# Altium project tesis.PrjPcb (part 1 of 3)
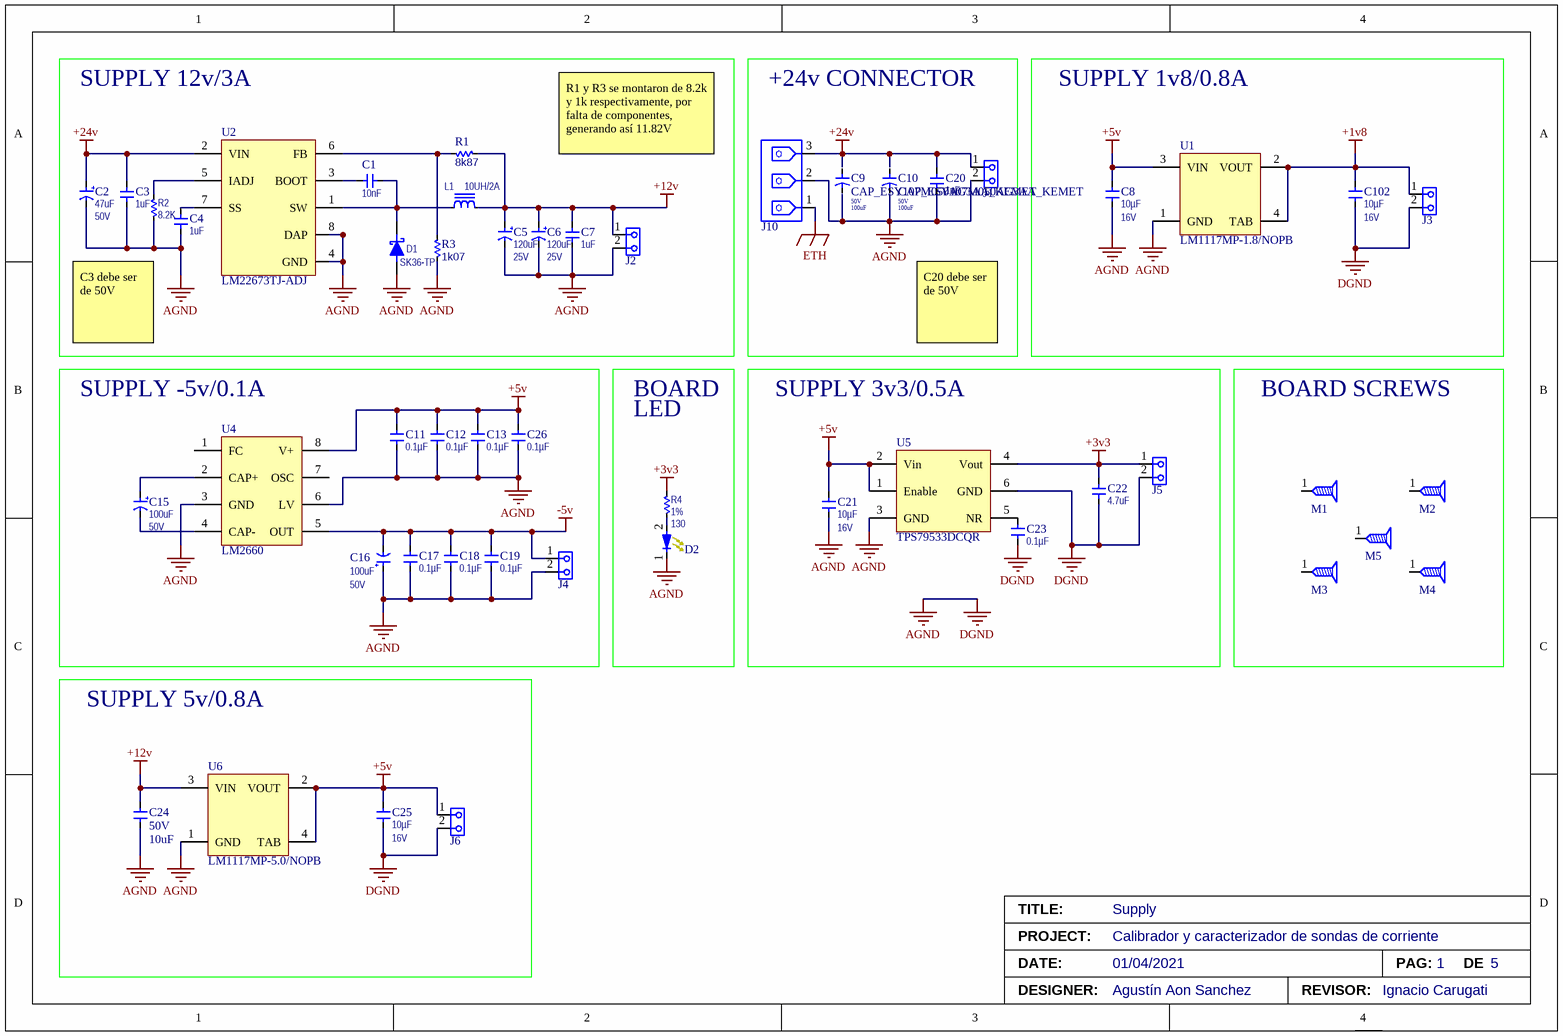
[diagram p0: tesis_page1_supply.SchDoc]
5 sheets, 272 parts. Net scope: global (net labels, ports and power ports of the same name join across sheets).
Board file: tesis.PcbDoc
Sheets:
  tesis_page1_supply.SchDoc
  tesis_page2_arm.SchDoc
  tesis_page3_power_stage.SchDoc
  tesis_page4_adc.SchDoc
  tesis_page5_adc_channels.SchDoc

## Sheet tesis_page1_supply.SchDoc: Supply
size A4; Date: 01/04/2021; Author: Agustín Aon Sanchez; DrawnBy: Agustín Aon Sanchez; SheetNumber: 1; SheetTotal: 5

### Parts
C1  value 10nF  [CAPC3216X135N_B]  (hidden comment: CAP_C3216X7R2J103K115AA_TDK)
C2  value 47uF  Voltage Rating: 50V  [CAPAE630770X770N]  (hidden comment: CAP_EEE-1HA470XP_PANASONIC)
C3  value 1uF  [CAPC3216X135N_B]  (hidden comment: CAP_C3216X7R1E105M085AA_TDK)
C4  value 1uF  [CAPC3216X135N_B]  (hidden comment: CAP_C3216X7R1E105M085AA_TDK)
C5  value 120uF  Voltage Rating: 25V  [CAPPRD250W50D630H1250]  (hidden comment: CAP_ELXY250ELL121MF15D_UC)
C6  value 120uF  Voltage Rating: 25V  [CAPPRD250W50D630H1250]  (hidden comment: CAP_ELXY250ELL121MF15D_UC)
C7  value 1uF  [CAPC3216X135N_B]  (hidden comment: CAP_C3216X7R1E105M085AA_TDK)
C8  value 10µF  Voltage Rating: 16V  [CAPC2013X110N]  (hidden comment: CAP_CL21A106KOCL3RC)
C9  CAP_ESY107M050AG3AA_KEMET  Voltage: 50V  Capacitance: 100uF  [cap elec 8x11.5]
C10  CAP_ESY107M050AG3AA_KEMET  Voltage: 50V  Capacitance: 100uF  [cap elec 8x11.5]
C11  value 0.1µF  [CAPC2013X110N]  (hidden comment: CAP_CC0805KRX7R8BB104_YAGEO)
C12  value 0.1µF  [CAPC2013X110N]  (hidden comment: CAP_CC0805KRX7R8BB104_YAGEO)
C13  value 0.1µF  [CAPC2013X110N]  (hidden comment: CAP_CC0805KRX7R8BB104_YAGEO)
C15  value 100uF  Voltage Rating: 50V  [CAPPRD350W60D800H1200]  (hidden comment: CAP_   ESY107M050AG3AA_KEMET)
C16  value 100uF  Voltage Rating: 50V  [CAPPRD350W60D800H1200]  (hidden comment: CAP_   ESY107M050AG3AA_KEMET)
C17  value 0.1µF  [CAPC2013X110N]  (hidden comment: CAP_CC0805KRX7R8BB104_YAGEO)
C18  value 0.1µF  [CAPC2013X110N]  (hidden comment: CAP_CC0805KRX7R8BB104_YAGEO)
C19  value 0.1µF  [CAPC2013X110N]  (hidden comment: CAP_CC0805KRX7R8BB104_YAGEO)
C20  value 1uF  [CAPC3216X135N_B]
C21  value 10µF  Voltage Rating: 16V  [CAPC2013X110N]  (hidden comment: CAP_CL21A106KOCL3RC)
C22  value 4.7uF  [CAPC2013X110N]  (hidden comment: CAP_CC0805KKX5R8BB475_YAGEO_1)
C23  value 0.1µF  [CAPC2013X110N]  (hidden comment: CAP_CC0805KRX7R8BB104_YAGEO)
C24  value 10uF  Voltage Rating: 50V  [CAPC3216X135N_B]  (hidden comment: CAP_GRT31CR61H106ME01L)
C25  value 10µF  Voltage Rating: 16V  [CAPC2013X110N]  (hidden comment: CAP_CL21A106KOCL3RC)
C26  value 0.1µF  [CAPC2013X110N]  (hidden comment: CAP_CC0805KRX7R8BB104_YAGEO)
C102  value 10µF  Voltage Rating: 16V  [CAPC2013X110N]  (hidden comment: CAP_CL21A106KOCL3RC)
D1  SK36-TP  [DIOM7959X262N]
D2  DIO_150080YS75000_WURTH  [DIO0805]  (value not drawn)
J1  CON_Header_1x2  [RAD2]  (value not drawn)
J2  CON_Header_1x2  [RAD2]  (value not drawn)
J3  CON_Header_1x2  [RAD2]  (value not drawn)
J4  CON_Header_1x2  [RAD2]  (value not drawn)
J5  CON_Header_1x2  [RAD2]  (value not drawn)
J6  CON_Header_1x2  [RAD2]  (value not drawn)
J10  CON_691137710003  [CON_691137710003]  (value not drawn)
L1  value 10UH/2A  [MAG_INDUCTOR2A]  (hidden comment: MAG_SRR1005-100M_BOURNS)
M1  MSC_SCREW  [MH320]  (value not drawn)  (no BOM)
M2  MSC_SCREW  [MH320]  (value not drawn)  (no BOM)
M3  MSC_SCREW  [MH320]  (value not drawn)  (no BOM)
M4  MSC_SCREW  [MH320]  (value not drawn)  (no BOM)
M5  MSC_SCREW  [MH320]  (value not drawn)  (no BOM)
R1  value 8k87  [RESC2013X065BN]  (hidden comment: RES_RC0805FR-078K87L)
R2  value 8.2K  [RESC3216N]  (hidden comment: RES_ERJ-8GEYJ822V_Panasonic)
R3  value 1k07  [RESC2013X065BN]  (hidden comment: RES_RC0805FR-071K07L)
R4  value 130  Tolerance: 1%  [RESC2013X065BN]  (hidden comment: RES_RC0805FR-07130RL_YAGEO)
U1  LM1117MP-1.8/NOPB  [SOT223-3L]
U2  LM22673TJ-ADJ  [TJ7A_N]
U4  LM2660  [SOIC127P600-8BN]
U5  TPS79533DCQR  [SOT223-6L]
U6  LM1117MP-5.0/NOPB  [SOT223-3L]

### Blocks framed on the sheet
SUPPLY 12v/3A: C1-C7 D1 J2 L1 R1-R3 U2
+24v CONNECTOR: C9 C10 C20 J1 J10
SUPPLY 1v8/0.8A: C8 C102 J3 U1
SUPPLY -5v/0.1A: C11-C13 C15-C19 C26 J4 U4
SUPPLY 3v3/0.5A: C21-C23 J5 U5
BOARD SCREWS: M1-M5
SUPPLY 5v/0.8A: C24 C25 J6 U6

### Nets
+1v8: C102.1(T1) J3.1 U1.2(VOUT) U1.4(TAB)
+3v3: C22.1(T1) J5.1 R4.2(T2) U5.4(Vout)
+5v: C8.1(T1) C11.1(T1) C12.1(T1) C13.1(T1) C21.1(T1) C25.1(T1) C26.1(T1) J6.1 U1.3(VIN) U4.8(V+) U5.1(Enable) U5.2(Vin) U6.2(VOUT) U6.4(TAB)
+12v: C5.1 C6.1 C7.1(T1) C24.1(T1) J2.1 L1.2 R1.1(T1) U6.3(VIN)
+24v: C2.1 C3.1(T1) C20.1(T1) J1.1 J10.3 U2.2(VIN)
-5v: C16.2 C17.1(T1) C18.1(T1) C19.1(T1) J4.1 U4.5(OUT)
AGND: C2.2 C3.2(T2) C4.2(T2) C5.2 C6.2 C7.2(T2) C8.2(T2) C11.2(T2) C12.2(T2) C13.2(T2) C16.1 C17.2(T2) C18.2(T2) C19.2(T2) C20.2(T2) C21.2(T2) C22.2(T2) C23.2(T2) C24.2(T2) C25.2(T2) C26.2(T2) C102.2(T2) D1.2(A) D2.1(Cathode) J1.2 J2.2 J3.2 J4.2 J5.2 J6.2 J10.2 R2.1(T1) R3.1(T1) U1.1(GND) U2.4(GND) U2.8(DAP) U4.3(GND) U4.6(LV) U5.3(GND) U5.6(GND) U6.1(GND)  [also labelled DGND]
ETH: J10.1
NetC1_1: C1.1(T1) U2.3(BOOT)
NetC1_2: C1.2(T2) D1.1(K) L1.1 U2.1(SW)
NetC4_1: C4.1(T1) U2.7(SS)
NetC15_1: C15.1 U4.2(CAP+)
NetC15_2: C15.2 U4.4(CAP-)
NetC23_1: C23.1(T1) U5.5(NR)
NetD2_2: D2.2(Anode) R4.1(T1)
NetR1_2: R1.2(T2) R3.2(T2) U2.6(FB)
NetR2_2: R2.2(T2) U2.5(IADJ)

Not connected (* = marked no-connect by the designer): C9 24 25; C10 24 25; M1 1; M2 1; M3 1; M4 1; M5 1; U4 1(FC) 7(OSC)

### Notes on the sheet
- R1 y R3 se montaron de 8.2k y 1k respectivamente, por falta de componentes, generando así 11.82V
- C3 debe ser de 50V
- C20 debe ser de 50V
- BOARD
- LED
- TITLE:
- PROJECT:
- DATE:
- DESIGNER:
- Calibrador y caracterizador de sondas de corriente
- 01/04/2021
- Agustín Aon Sanchez
- REVISOR:
- Ignacio Carugati
- PAG:
- DE

### Library data of the parts
C1 = CAP_C3216X7R2J103K115AA_TDK: 10000pF, 630 V, Capacitores cerámicos, X7R, 1206 (3216 métrico), 0.126" L x 0.063" A (3.20 mm x 1.60 mm); Manufacturer: TDK; Tolerance: 10%; Voltage Rating: 630 V; Supplier: *; Supplier Part No: *; Power Rating: *; BOM Populate: *; Digikey Part Number: 445-2291-1-ND; Mouser Part Number: 810-C3216X7R2J103K; Manufacturer Part Number: C3216X7R2J103K115AA
C2 = CAP_EEE-1HA470XP_PANASONIC: 47µF 50V Aluminum Capacitors Radial, Can - SMD 2000 Hrs @ 85°C; Tolerance: 20%; BOM Populate: *; Power Rating: *; Supplier Part No: *; Supplier: *; Manufacturer: Panasonic; Petra Part No: *; Digikey Part Number: PCE3929CT-ND; Mouser Part Number: 667-EEE-1HA470XP; Manufacturer Part Number: EEE-1HA470XP
C3 C4 C7 C20 = CAP_C3216X7R1E105M085AA_TDK: 1 µF, 25 V, Capacitores cerámicos, X7R, 1206 (3216 métrico), 0.126" L x 0.063" A (3.20 mm x 1.60 mm); Manufacturer: TDK; Tolerance: 20%; Voltage Rating: 25V; Supplier: *; Supplier Part No: *; Power Rating: *; BOM Populate: *; Digikey Part Number: 445-4024-1-ND; Mouser Part Number: 810-C3216X7R1E105M-2; Manufacturer Part Number: C3216X7R1E105M085AA
C5 C6 = CAP_ELXY250ELL121MF15D_UC: CAP ALUM 120UF 20% 25V RADIAL; BOM Populate: *; Power Rating: *; Supplier Part No: *; Supplier: *; Digikey Part Number: 565-1791-ND; Tolerance: 20%; Petra Part No: *; Mouser Part Number: 661-ELXY250ELL121MF1; Manufacturer Part Number: ELXY250ELL121MF15D
C8 C21 C25 C102 = CAP_CL21A106KOCL3RC: CAP CER 10UF 16V X5R 0805; Manufacturer: Samsung; Tolerance: 10%; Manufacturer Part Number: CL21A106KOCL3RC; Supplier 1: Future Electronics; RoHS: Yes; Category: Ceramic Capacitors; Stock 1: 3934; Pricing 1: 1=0,10400, 50=0,08230, 100=0,07900, 500=0,07190, 1500=0,06740 (USD); Mount: Surface Mount; Case/Package: 0805; Case Code (Metric): 2012; Case Code (Imperial): 0805; Min Operating Temperature: -55°C; Max Operating Temperature: 85°C; Package Quantity: 1; Packaging: Tape and Reel; Length: 0.079inch; Width: 0.049inch; Thickness: 0.037inch; ComponentLink1URL: https://datasheet.ciiva.com/25796/cl21a106kocl3rc-25796224.pdf?src-supplier=Digi-Key; ComponentLink1Description: https://datasheet.ciiva.com/25796/cl21a106kocl3rc-25796224.pdf?src-supplier=Digi-Key; Supplier Part Number 1: 8109145; Capacitance: 10µF
C9 C10 = CAP_ESY107M050AG3AA_KEMET: KEMET - ESY107M050AG3AA - Elektrolytkondensator, 100 µF, 50 V, Produktreihe ESY, ± 20%, Radial bedrahtet, 8 mm; Dielectric Material: Aluminium; Ripple Current: 511mA; Life (Hours): 3000Hour; Leakage Current: 50uA; Dissipation Factor: 0.1%; Lead/Base Style: Straight; Impedance: 74mR; Lead Diameter: 0.6mm; Lead Length: 20mm; Tolerance: 20%; Voltage Rating: 50V; Supplier 1: Digi-Key; Manufacturer 1: KEMET; Manufacturer Part Number 1: ESY107M050AG3AA; Stock 1: 587; Pricing 1: 1=0,44000, 10=0,30700, 50=0,21500, 100=0,18420, 500=0,13818, 1000=0,11668, 2500=0,11054, 5000=0,10440 (USD); RoHS: Yes; Mount: Through Hole,PCB; Case/Package: Radial; Min Operating Temperature: -40°C; Max Operating Temperature: 105°C; Termination: Radial; Packaging: Bulk; Voltage Rating (DC): 50V; Package Quantity: 6000; Series: ESY; ESR (Equivalent Series Resistance): 74mR; Diameter: 8mm; Length: 11mm; Height: 11mm; Lead Pitch: 3.5mm; Height - Seated (Max): 0.492inch; Radiation Hardening: No; RoHS Compliant: Yes; ComponentLink1URL: http://www.farnell.com/datasheets/2751412.pdf?src-supplier=Farnell; ComponentLink1Description: http://www.farnell.com/datasheets/2751412.pdf?src-supplier=Farnell; ComponentLink2URL: http://www.mouser.com/ds/2/212/KEM_A4007_ESY-1103537.pdf?src-supplier=Mouser; ComponentLink2Description: http://www.mouser.com/ds/2/212/KEM_A4007_ESY-1103537.pdf?src-supplier=Mouser; ComponentLink3URL: http://components.arrow.com/part/dataview/0323_06946698?src-supplier=Arrow+Europe; ComponentLink3Description: http://components.arrow.com/part/dataview/0323_06946698?src-supplier=Arrow+Europe; ComponentLink4URL: https://www.alliedelec.com/m/d/2f7883d23207e2a46fd2b27bea013c02.pdf?src-supplier=Allied+Electronics; ComponentLink4Description: https://www.alliedelec.com/m/d/2f7883d23207e2a46fd2b27bea013c02.pdf?src-supplier=Allied+Electronics; ComponentLink5URL: http://uk.rs-online.com/webdocs/13da/0900766b813da6ab.pdf?src-supplier=RSComponents; ComponentLink5Description: http://uk.rs-online.com/webdocs/13da/0900766b813da6ab.pdf?src-supplier=RSComponents; ComponentLink6URL: https://api.kemet.com/component-edge/download/specsheet/ESY107M050AG3AA.pdf?src-supplier=Digi-Key; ComponentLink6Description: https://api.kemet.com/component-edge/download/specsheet/ESY107M050AG3AA.pdf?src-supplier=Digi-Key; ComponentLink7URL: http://capacitoredge.kemet.com/capedge2/DataSheet?pn=ESY107M050AG3AA&src-supplier=Avnet; ComponentLink7Description: http://capacitoredge.kemet.com/capedge2/DataSheet?pn=ESY107M050AG3AA&src-supplier=Avnet; ComponentLink8URL: http://capacitoredge.kemet.com/capedge2/DataSheet/Datasheet-ESY107M050AG3AA.pdf?pn=ESY107M050AG3AA&src-supplier=Onlinecomponents.com; ComponentLink8Description: http://capacitoredge.kemet.com/capedge2/DataSheet/Datasheet-ESY107M050AG3AA.pdf?pn=ESY107M050AG3AA&src-supplier=Onlinecomponents.com; ComponentLink9URL: http://capacitoredge.kemet.com/capedge2/DataSheet?pn=ESY107M050AG3AA&src-supplier=Avnet+Europe; ComponentLink9Description: http://capacitoredge.kemet.com/capedge2/DataSheet?pn=ESY107M050AG3AA&src-supplier=Avnet+Europe; ComponentLink10URL: http://www.farnell.com/datasheets/2751412.pdf?src-supplier=Newark; ComponentLink10Description: http://www.farnell.com/datasheets/2751412.pdf?src-supplier=Newark; Supplier Part Number 1: 399-6119-ND
C11-C13 C17-C19 C23 C26 = CAP_CC0805KRX7R8BB104_YAGEO: CAP CER 0.1UF 25V 10% X7R 0805; Manufacturer: Yageo; Digikey Part Number: 311-1141-1-ND; Supplier: *; Tolerance: 10%; Power Rating: *; Voltage Rating: 25V; BOM Populate: *; Mouser Part Number: 603-CC805KRX7R8BB104; Manufacturer Part Number: CC0805KRX7R8BB104
C15 C16 = CAP_   ESY107M050AG3AA_KEMET: CAP ALUM 100UF 20% 50V RADIAL; BOM Populate: *; Power Rating: *; Supplier Part No: *; Supplier: *; Digikey Part Number: 399-6119-ND; Tolerance: 20%; Petra Part No: *; Mouser Part Number: 80-ESY107M050AG3AA; Manufacturer Part Number: ESY107M050AG3AA
C22 = CAP_CC0805KKX5R8BB475_YAGEO_1: CAP CER 4.7UF 25V X5R 0805; Manufacturer: YAGEO; Tolerance: 10%; Voltage Rating: 25V; Digikey Part Number: 311-1904-1-ND; Mouser Part Number: 603-CC805KKX5R8BB475; Manufacturer Part Number: CC0805KKX5R8BB475
C24 = CAP_GRT31CR61H106ME01L: Cap Ceramic 10uF 50V X5R 20% Pad SMD 1206 85C Automotive T/R; Manufacturer: Murata; Tolerance: 20%; Manufacturer Part Number: GRT31CR61H106ME01L; Supplier 1: Digi-Key; RoHS: Yes; Category: Ceramic Capacitors; Stock 1: 575627; Pricing 1: 1=0,46000, 10=0,31800, 50=0,22240, 100=0,19060, 500=0,14294, 1000=0,12070 (USD); Mount: Surface Mount; Case/Package: 1206; Case Code (Metric): 3216; Case Code (Imperial): 1206; Min Operating Temperature: -55°C; Max Operating Temperature: 85°C; Packaging: Tape and Reel; Length: 0.126inch; Width: 0.063inch; Thickness: 0.071inch; ComponentLink1URL: http://search.murata.co.jp/Ceramy/image/img/A01X/G101/ENG/GRT31CR61H106ME01-01.pdf?src-supplier=Digi-Key; ComponentLink1Description: http://search.murata.co.jp/Ceramy/image/img/A01X/G101/ENG/GRT31CR61H106ME01-01.pdf?src-supplier=Digi-Key; Supplier Part Number 1: 490-12457-1-ND; Ratings: AEC-Q200; RoHS Compliant: Yes
D1 = DIO_SK36_MICROCOM: DIODE SCHOTTKY 60V 3A SMC; Manufacturer: Micro Commercial Co; Digikey Part Number: SK36-TPMSCT-ND; Manufacturer Part Number: SK36-TP; Mouser Part Number: 833-SK36-TP
D2 = DIO_150080YS75000_WURTH: LED YELLOW CLEAR 0805 SMD; Manufacturer: Wurth Electronics Inc.; Manufacturer Part Number: 150080YS75000; Digikey Part Number: 732-4987-1-ND; Mouser Part Number: 710-150080YS75000
J10 = CON_691137710003: TERM BLK 3POS SIDE ENTRY 5MM PCB; Manufacturer: Wurth Electronics; Supplier 1: Digi-Key; Supplier Part Number 1: 732-10956-ND; Manufacturer Part Number: 691137710003; RoHS: No; Stock 1: 910; Pricing 1: 1=0,62000, 10=0,55000, 50=0,49000, 100=0,44000, 500=0,42000 (USD); ComponentLink1URL: https://katalog.we-online.de/em/datasheet/691137710003.pdf?src-supplier=Digi-Key; ComponentLink1Description: https://katalog.we-online.de/em/datasheet/691137710003.pdf?src-supplier=Digi-Key
L1 = MAG_SRR1005-100M_BOURNS: FIXED IND 10UH 2A 65 MOHM SMD; Manufacturer: Bourns Inc; BOM Populate: *; Current Rating: *; Supplier: *; Supplier Part No: *; Voltage Rating: *; Tolerance: *; Digikey Part Number: SRR1005-100MCT-ND; Manufacturer Part Number: SRR1005-100M; Mouser Part Number: 652-SRR1005-100M
M1-M5 = MSC_SCREW: SCREW; BOM Populate: *; Tolerance: *; Power Rating: *; Voltage Rating: *
R1 = RES_RC0805FR-078K87L: Res Thick Film 0805 8.87K Ohm 1% 0.125W(1/8W) ±100ppm/C Epoxy Pad SMD T/R; Manufacturer: Yageo; Temperature Coefficient: 100ppm/°C; Power Rating: 125mW; Voltage Rating: 150V; Supplier 1: Digi-Key; Supplier Part Number 1: 311-8.87KCRCT-ND; Manufacturer Part Number: RC0805FR-078K87L; Category: Chip SMD Resistors; Case/Package: 0805; Contact Plating: Tin,Lead,Matte; Case Code (Metric): 2012; Case Code (Imperial): 0805; Size Code: 0805; Min Operating Temperature: -55°C; Max Operating Temperature: 155°C; Tolerance: 1%; Resistor Type: Thick Film; Package Quantity: 1; Packaging: Tape and Reel; Number of Terminations: 2; Termination: SMD/SMT; Max Power Dissipation: 125mW; Voltage Rating (DC): 150V; Features: Moisture Resistant; Series: RC; Construction: Rectangular; Length: 2mm; Width: 0.049inch; Height: 0.024inch; Depth: 1.25mm; Radiation Hardening: No; Military Standard: Not; Lead Free: Lead Free; RoHS Compliant: Yes; ComponentLink1URL: https://datasheet.ciiva.com/17423/rc0805-17423031.pdf?src-supplier=Future+Electronics; ComponentLink1Description: https://datasheet.ciiva.com/17423/rc0805-17423031.pdf?src-supplier=Future+Electronics; ComponentLink2URL: https://datasheet.ciiva.com/2491/pyu-r-int-thick-7-2491576.pdf?src-supplier=Digi-Key; ComponentLink2Description: https://datasheet.ciiva.com/2491/pyu-r-int-thick-7-2491576.pdf?src-supplier=Digi-Key; ComponentLink3URL: https://datasheet.ciiva.com/2491/pyu-r-int-thick-7-2491577.pdf?src-supplier=Digi-Key; ComponentLink3Description: https://datasheet.ciiva.com/2491/pyu-r-int-thick-7-2491577.pdf?src-supplier=Digi-Key; ComponentLink4URL: https://datasheet.ciiva.com/2491/pyu-r-int-thick-7-2491578.pdf?src-supplier=Digi-Key; ComponentLink4Description: https://datasheet.ciiva.com/2491/pyu-r-int-thick-7-2491578.pdf?src-supplier=Digi-Key
R2 = RES_ERJ-8GEYJ822V_Panasonic: RES SMD 8.2K OHM 5% 1/4W 1206; BOM Populate: *; Supplier Part No: *; Supplier: *; Tolerance: 5%; Manufacturer: Panasonic; Digikey Part Number: P8.2KECT-ND; Power Rating: 1/4W; Manufacturer Part Number: ERJ-8GEYJ822V; Mouser Part Number: 667-ERJ-8GEYJ822V
R3 = RES_RC0805FR-071K07L: Res Thick Film 0805 1.07K Ohm 1% 1/8W 100ppm/C Molded SMD Paper T/R; Manufacturer: Yageo; Resistance: 1.07kR; Temperature Coefficient: 100ppm/°C; Power Rating: 125mW; Voltage Rating: 150V; Supplier 1: Digi-Key; Manufacturer Part Number: RC0805FR-071K07L; RoHS: Yes; Category: Chip SMD Resistors; Stock 1: 47079; Pricing 1: 1=0,10000, 10=0,04000, 100=0,01620, 1000=0,00726, 2500=0,00630 (USD); Case/Package: 0805; Contact Plating: Tin,Matte; Case Code (Imperial): 0805; Case Code (Metric): 2012; Size Code: 0805; Min Operating Temperature: -55°C; Max Operating Temperature: 155°C; Tolerance: 1%; Resistor Type: Thick Film; Packaging: Tape and Reel; Package Quantity: 1; Termination: SMD/SMT; Number of Terminations: 2; Max Power Dissipation: 125mW; Voltage Rating (DC): 150V; Features: Moisture Resistant; Series: RC; Construction: Rectangular; Length: 2mm; Width: 1.25mm; Height: 0.024inch; Depth: 1.25mm; Military Standard: Not; Lead Free: Lead Free; RoHS Compliant: Yes; ComponentLink1URL: https://datasheet.ciiva.com/17054/rc0805-17054582.pdf?src-supplier=Future+Electronics; ComponentLink1Description: https://datasheet.ciiva.com/17054/rc0805-17054582.pdf?src-supplier=Future+Electronics; ComponentLink2URL: https://datasheet.ciiva.com/2491/pyu-r-int-thick-7-2491690.pdf?src-supplier=Digi-Key; ComponentLink2Description: https://datasheet.ciiva.com/2491/pyu-r-int-thick-7-2491690.pdf?src-supplier=Digi-Key; ComponentLink3URL: https://datasheet.ciiva.com/2491/pyu-r-int-thick-7-2491691.pdf?src-supplier=Digi-Key; ComponentLink3Description: https://datasheet.ciiva.com/2491/pyu-r-int-thick-7-2491691.pdf?src-supplier=Digi-Key; ComponentLink4URL: https://datasheet.ciiva.com/2491/pyu-r-int-thick-7-2491692.pdf?src-supplier=Digi-Key; ComponentLink4Description: https://datasheet.ciiva.com/2491/pyu-r-int-thick-7-2491692.pdf?src-supplier=Digi-Key; Supplier Part Number 1: 311-1.07KCRCT-ND
R4 = RES_RC0805FR-07130RL_YAGEO: RES SMD 130 OHM 1% 1/8W 0805; Manufacturer: Yageo; BOM Populate: *; Supplier Part No: *; Supplier: *; Digikey Part Number: 311-130CRCT-ND; Power Rating: 1/8W; Manufacturer Part Number: RC0805FR-07130RL; Mouser Part Number: 603-RC0805FR-07130RL
U1 = IC_LM1117MP-1.8/NOPB: IC REG LDO 1.8V .8A SOT-223-4; Manufacturer: TI National Semiconductor; Number of Terminals/Pins: 4; Number of Outputs: 1; Max Input Voltage: 15V; Max Output Current: 800mA; Polarity: Positive; Quiescent Current: 10mA; Accuracy: 1%; Output Type: Fixed; Dropout Voltage: 1.2V; Min Input Voltage: 2.6V; Current Rating: 800A; Supplier 1: Digi-Key; Manufacturer Part Number: LM1117MP-1.8/NOPB; RoHS: Yes; Category: Voltage Regulators - Linear; Stock 1: 6695; Pricing 1: 1=1,10000, 10=0,98500, 25=0,93520, 100=0,71810, 250=0,63460, 500=0,60120 (USD); Mount: Surface Mount; Case/Package: SOT-223; Number of Pins: 4; Min Operating Temperature: 0°C; Max Operating Temperature: 125°C; Output Voltage: 1.8V; Output Current: 800mA; Packaging: Tape and Reel; Nominal Output Voltage: 1.8V; Output Voltage Accuracy: 1%; Package Quantity: 1000; Length: 6.5mm; Width: 3.56mm; Height: 1.6mm; Radiation Hardening: No; REACH SVHC: No SVHC; Lead Free: Lead Free; Supplier Part Number 1: LM1117MP-1.8/NOPBCT-ND
U2 = IC_LM22673TJ-ADJ: 3A SIMPLE SWITCHER® Step-Down Voltage Regulator with Adjustable Soft-Start and Current Limit, 7-pin TO-263 Thin; Manufacturer Part Number: LM22673TJ-ADJ/NOPB; Digikey Part Number: LM22673TJ-ADJ/NOPBCT-ND; Mouser Part Number: 926-LM22673TJADJNOPB
U4 = IC_LM2660MX/NOPB_1: IC REG SWTCHD CAP INV 0.1A 8SOIC; Digikey Part Number: LM2660MX/NOPBCT-ND; Manufacturer Part Number: LM2660MX/NOPB; Mouser Part Number: 926-LM2660MX/NOPB
U5 = IC_TPS79533DCQR_TI: IC REG LIN 3.3V 500MA SOT223-6; Manufacturer Part Number: 595-TPS79533DCQR; Digikey Part Number: 296-13810-1-ND; Mouser Part Number: TPS79533DCQR
U6 = IC_LM1117MP-5.0/NOPB: IC REG LDO 5V .8A SOT-223-4; Manufacturer: TI National Semiconductor; Number of Outputs: 1; Max Input Voltage: 15V; Max Output Current: 800mA; Polarity: Positive; Quiescent Current: 5mA; Accuracy: 1%; Output Type: Fixed; Dropout Voltage: 1.2V; Min Input Voltage: 2.6V; Current Rating: 800A; Max Supply Voltage: 12V; Max Supply Current: 10mA; Power Supply Rejection Ratio (PSRR): 75dB; Supplier 1: Digi-Key; Manufacturer Part Number: LM1117MP-5.0/NOPB; RoHS: Yes; Category: Voltage Regulators - Linear; Stock 1: 1093; Pricing 1: 1=1,17000, 10=1,04400, 25=0,99120, 100=0,76120, 250=0,67268, 500=0,63728 (USD); Mount: Surface Mount; Case/Package: SOT-223; Number of Pins: 4; Min Operating Temperature: 0°C; Max Operating Temperature: 125°C; Output Voltage: 5V; Output Current: 800mA; Packaging: Tape and Reel; Nominal Output Voltage: 5V; Output Voltage Accuracy: 1%; Package Quantity: 1000; Length: 6.5mm; Width: 3.56mm; Height: 1.6mm; Radiation Hardening: No; REACH SVHC: No SVHC; Lead Free: Lead Free; Supplier Part Number 1: LM1117MP-5.0/NOPBCT-ND; Contact Plating: Tin,Matte; Number of Regulators: 1; Min Current Limit: 800mA; Series: -; Output Configuration: Positive; RoHS Compliant: Yes

## Sheet tesis_page2_arm.SchDoc: ARM
size A4; Date: 01/04/2021; SheetNumber: 2; SheetTotal: 5
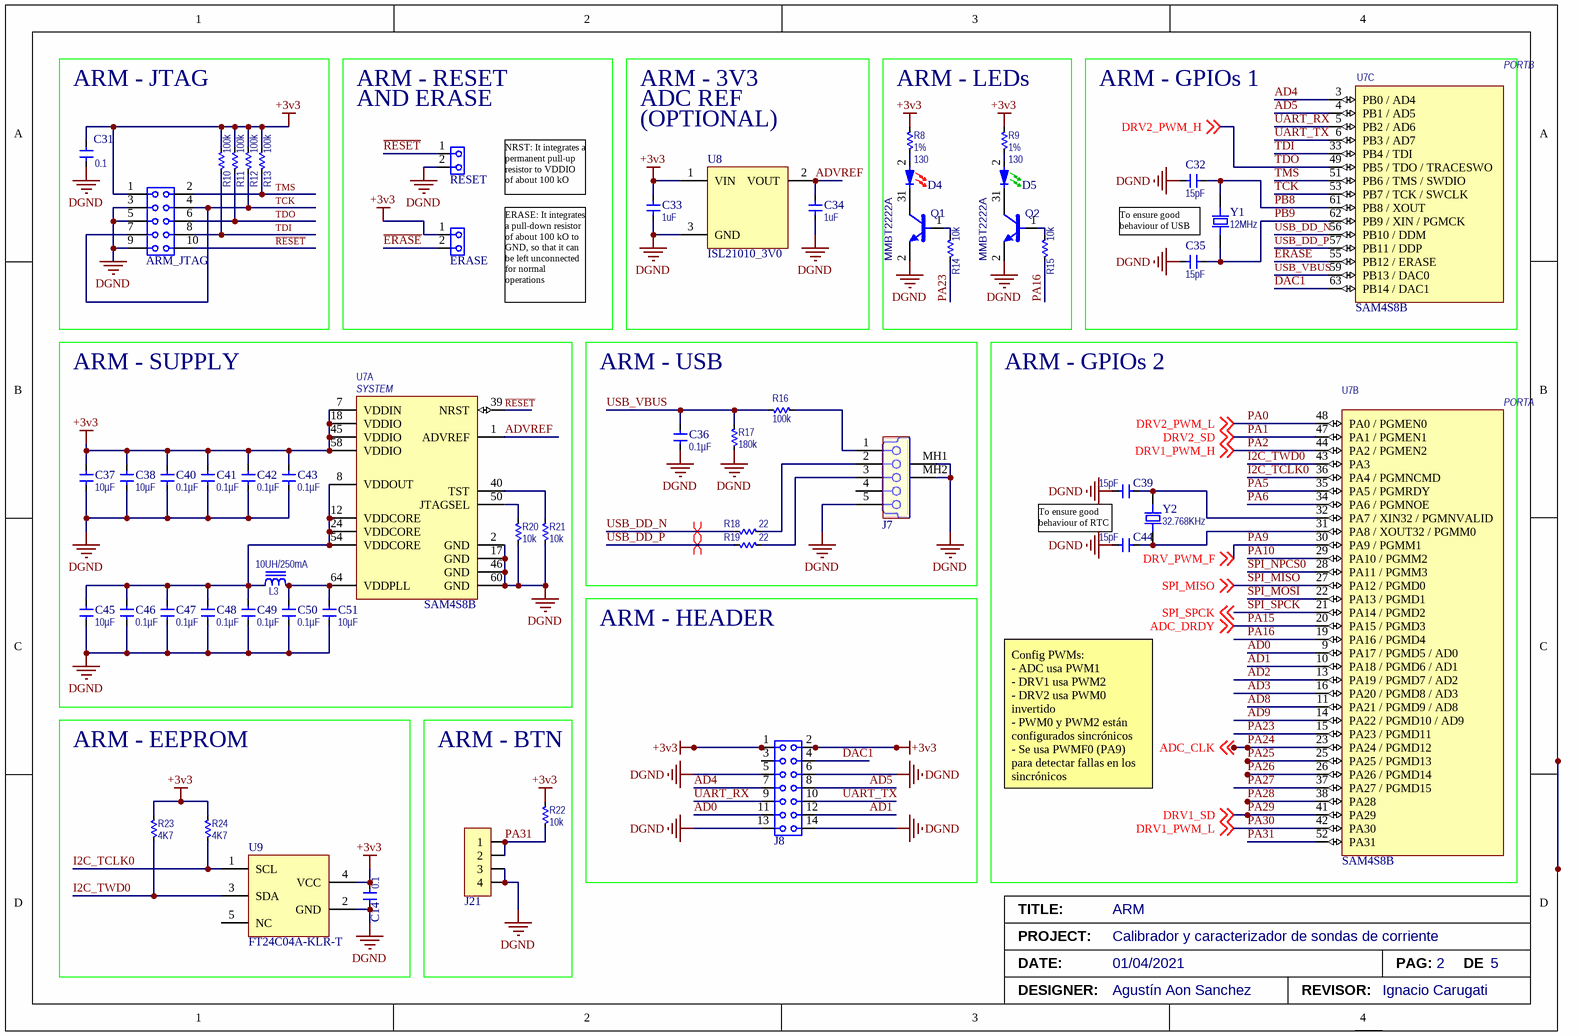
[diagram p1: tesis_page2_arm.SchDoc]

### Parts
ARM_JTAG  CON_20021121-00010C4LF_FCI  [FCI_20021121-00010C4LF]  (value not drawn)
C14  value 0.1  [CAPC2013X110N]  (hidden comment: CAP_CC0805KRX7R8BB104_YAGEO)
C31  value 0.1  [CAPC2013X110N]  (hidden comment: CAP_CC0805KRX7R8BB104_YAGEO)
C32  value 15pF  [CAPC2013X110N]  (hidden comment: CAP_C0805X150J5GACTU_KEMET)
C33  value 1uF  [CAPC2013X110N]  (hidden comment: CAP_CC0805KKX7R7BB105_YAGEO)
C34  value 1uF  [CAPC2013X110N]  (hidden comment: CAP_CC0805KKX7R7BB105_YAGEO)
C35  value 15pF  [CAPC2013X110N]  (hidden comment: CAP_C0805X150J5GACTU_KEMET)
C36  value 0.1µF  [CAPC2013X110N]  (hidden comment: CAP_CC0805KRX7R8BB104_YAGEO)
C37  value 10µF  [CAPC2013X110N]  (hidden comment: CAP_CL21A106KOCL3RC)
C38  value 10µF  [CAPC2013X110N]  (hidden comment: CAP_CL21A106KOCL3RC)
C39  value 15pF  [CAPC2013X110N]  (hidden comment: CAP_C0805X150J5GACTU_KEMET)
C40  value 0.1µF  [CAPC2013X110N]  (hidden comment: CAP_CC0805KRX7R8BB104_YAGEO)
C41  value 0.1µF  [CAPC2013X110N]  (hidden comment: CAP_CC0805KRX7R8BB104_YAGEO)
C42  value 0.1µF  [CAPC2013X110N]  (hidden comment: CAP_CC0805KRX7R8BB104_YAGEO)
C43  value 0.1µF  [CAPC2013X110N]  (hidden comment: CAP_CC0805KRX7R8BB104_YAGEO)
C44  value 15pF  [CAPC2013X110N]  (hidden comment: CAP_C0805X150J5GACTU_KEMET)
C45  value 10µF  [CAPC2013X110N]  (hidden comment: CAP_CL21A106KOCL3RC)
C46  value 0.1µF  [CAPC2013X110N]  (hidden comment: CAP_CC0805KRX7R8BB104_YAGEO)
C47  value 0.1µF  [CAPC2013X110N]  (hidden comment: CAP_CC0805KRX7R8BB104_YAGEO)
C48  value 0.1µF  [CAPC2013X110N]  (hidden comment: CAP_CC0805KRX7R8BB104_YAGEO)
C49  value 0.1µF  [CAPC2013X110N]  (hidden comment: CAP_CC0805KRX7R8BB104_YAGEO)
C50  value 0.1µF  [CAPC2013X110N]  (hidden comment: CAP_CC0805KRX7R8BB104_YAGEO)
C51  value 10µF  [CAPC2013X110N]  (hidden comment: CAP_CL21A106KOCL3RC)
D4  DIO_150080RS75000_WURTH  [DIO0805]  (value not drawn)
D5  DIO_150080VS75000_WURTH  [DIO0805]  (value not drawn)
ERASE  CON_Header_1x2  [RAD2]  (value not drawn)
J7  CON_MINI_USB  [UBS MiniB]  (value not drawn)
J8  CON_Header_CAL_1  [HeaderCAL_1]  (value not drawn)
J21  MSC_B3F-1000_OMRON  [SW_1825910-6]  (value not drawn)
L3  value 10UH/250mA  [INDC4532X170N]  (hidden comment: MAG_PM1812-100J-RC)
Q1  MMBT2222A  [SOT23-3M]
Q2  MMBT2222A  [SOT23-3M]
R8  value 130  Tolerance: 1%  [RESC2013X065BN]  (hidden comment: RES_RC0805FR-07130RL_YAGEO)
R9  value 130  Tolerance: 1%  [RESC2013X065BN]  (hidden comment: RES_RC0805FR-07130RL_YAGEO)
R10  value 100k  [RESC2013X065BN]  (hidden comment: RES_AC0805JR-07100KL_YAGEO)
R11  value 100k  [RESC2013X065BN]  (hidden comment: RES_AC0805JR-07100KL_YAGEO)
R12  value 100k  [RESC2013X065BN]  (hidden comment: RES_AC0805JR-07100KL_YAGEO)
R13  value 100k  [RESC2013X065BN]  (hidden comment: RES_AC0805JR-07100KL_YAGEO)
R14  value 10k  [RESC2013X065BN]  (hidden comment: RES_RC0805FR-0710KL_YAGEO)
R15  value 10k  [RESC2013X065BN]  (hidden comment: RES_RC0805FR-0710KL_YAGEO)
R16  value 100k  [RESC3216N]  (hidden comment: RES_RC1206JR-07100KL_YAGEO)
R17  value 180k  [RESC3216N]  (hidden comment: RES_RC1206JR-07180KL_YAGEO)
R18  value 22  [RESC2013X065BN]  (hidden comment: RES_AC0805JR-0722RL_YAGEO)
R19  value 22  [RESC2013X065BN]  (hidden comment: RES_AC0805JR-0722RL_YAGEO)
R20  value 10k  [RESC2013X065BN]  (hidden comment: RES_RC0805JR-0710KL_YAGEO)
R21  value 10k  [RESC2013X065BN]  (hidden comment: RES_RC0805JR-0710KL_YAGEO)
R22  value 10k  [RESC2013X065BN]  (hidden comment: RES_RC0805JR-0710KL_YAGEO)
R23  value 4K7  [RESC2013X065BN]  (hidden comment: RES_RC0805FR-074K7L_YAGEO)
R24  value 4K7  [RESC2013X065BN]  (hidden comment: RES_RC0805FR-074K7L_YAGEO)
RESET  CON_Header_1x2  [RAD2]  (value not drawn)
U7  SAM4S8B  [TQFP50P1000X1000X160-64N]  (parts A,B,C of 3)
U8  ISL21010_3V0  [SOT23-3M]
U9  FT24C04A-KLR-T  [SOT23-5AM]
Y1  value 12MHz  [CSM-3X]  (hidden comment: MSC_ECS-120-20-3X-TR_ECS)
Y2  value 32.768KHz  [XTAL3215X090N]  (hidden comment: MSC_ECS-.327-12.5-34S-TR_ECS)

### Blocks framed on the sheet
ARM - JTAG: ARM_JTAG C31 R10-R13
ARM - LEDs: D4 D5 Q1 Q2 R8 R9 R14 R15
ARM - GPIOs 1: C32 C35 U7 Y1
ARM - SUPPLY: C37 C38 C40-C43 C45-C51 L3 R20 R21 U7
ARM - USB: C36 J7 R16-R19
ARM - GPIOs 2: C39 C44 U7 Y2
ARM - HEADER: J8
ARM - EEPROM: C14 R23 R24 U9
ARM - BTN: J21 R22

### Nets
+3v3: ARM_JTAG.1 C14.2(T2) C31.1(T1) C33.1(T1) C37.2(T2) C38.2(T2) C40.2(T2) C41.2(T2) C42.2(T2) C43.2(T2) ERASE.1 J8.1 J8.2 R8.2(T2) R9.2(T2) R10.2(T2) R11.2(T2) R12.2(T2) R13.2(T2) R22.2(T2) R23.2(T2) R24.2(T2) U7.7(VDDIN) U7.18(VDDIO) U7.45(VDDIO) U7.58(VDDIO) U8.1(VIN) U9.4(VCC)
DGND: ARM_JTAG.3 ARM_JTAG.5 ARM_JTAG.9 C14.1(T1) C31.2(T2) C32.2(T2) C33.2(T2) C34.2(T2) C35.1(T1) C36.1(T1) C37.1(T1) C38.1(T1) C39.2(T2) C40.1(T1) C41.1(T1) C42.1(T1) C43.1(T1) C44.2(T2) C45.1(T1) C46.2(T2) C47.2(T2) C48.2(T2) C49.2(T2) C50.1(T1) C51.2(T2) J7.5 J7.MH1 J7.MH2 J8.5 J8.6 J8.13 J8.14 J21.3 J21.4 Q1.2(E) Q2.2(E) R17.2(T2) R20.1(T1) R21.1(T1) RESET.2 U7.2(GND) U7.17(GND) U7.46(GND) U7.60(GND) U8.3(GND) U9.2(GND)  [project net AGND]
AD0: J8.11 U7.9(PA17_/_PGMD5_/_AD0)
AD1: J8.12 U7.10(PA18_/_PGMD6_/_AD1)
AD2: U7.13(PA19_/_PGMD7_/_AD2)
AD3: U7.16(PA20_/_PGMD8_/_AD3)
AD4: J8.7 U7.3(PB0_/_AD4)
AD5: J8.8 U7.4(PB1_/_AD5)
AD8: U7.11(PA21_/_PGMD9_/_AD8)
AD9: U7.14(PA22_/_PGMD10_/_AD9)
ADVREF: C34.1(T1) U7.1(ADVREF) U8.2(VOUT)
DAC1: J8.4 U7.63(PB14_/_DAC1)
~{ERASE}: ERASE.2 U7.55(PB12_/_ERASE)
I2C_TCLK0: R24.1(T1) U7.36(PA4_/_PGMNCMD) U9.1(SCL)
I2C_TWD0: R23.1(T1) U7.43(PA3) U9.3(SDA)
PA0: U7.48(PA0_/_PGMEN0) ; off-sheet DRV2_PWM_L  [also labelled DRV2_PWM_L]
PA1: U7.47(PA1_/_PGMEN1) ; off-sheet DRV2_SD  [also labelled DRV2_SD]
PA2: U7.44(PA2_/_PGMEN2) ; off-sheet DRV1_PWM_H  [also labelled DRV1_PWM_H]
PA5: U7.35(PA5_/_PGMRDY)
PA6: U7.34(PA6_/_PGMNOE)
PA9: U7.30(PA9_/_PGMM1) ; off-sheet DRV_PWM_F  [also labelled DRV_PWM_F]
PA10: U7.29(PA10_/_PGMM2)
PA15: U7.20(PA15_/_PGMD3) ; off-sheet ADC_DRDY  [also labelled ADC_DRDY]
PA16: R15.2(T2) U7.19(PA16_/_PGMD4)
PA23: R14.2(T2) U7.15(PA23_/_PGMD11)
PA24: U7.23(PA24_/_PGMD12) ; off-sheet ADC_CLK  [also labelled ADC_CLK]
PA25: U7.25(PA25_/_PGMD13)
PA26: U7.26(PA26_/_PGMD14)
PA27: U7.37(PA27_/_PGMD15)
PA28: U7.38(PA28)
PA29: U7.41(PA29) ; off-sheet DRV1_SD  [also labelled DRV1_SD]
PA30: U7.42(PA30) ; off-sheet DRV1_PWM_L  [also labelled DRV1_PWM_L]
PA31: J21.1 J21.2 R22.1(T1) U7.52(PA31)
PB8: C32.1(T1) U7.61(PB8_/_XOUT) Y1.2
PB9: C35.2(T2) U7.62(PB9_/_XIN_/_PGMCK) Y1.1
~{RESET}: ARM_JTAG.10 RESET.1 U7.39(NRST)
SPI_MISO: U7.27(PA12_/_PGMD0) ; off-sheet SPI_MISO
SPI_MOSI: U7.22(PA13_/_PGMD1)
SPI_NPCS0: U7.28(PA11_/_PGMM3)
SPI_SPCK: U7.21(PA14_/_PGMD2) ; off-sheet SPI_SPCK
TCK: ARM_JTAG.4 ARM_JTAG.7 R12.1(T1) U7.53(PB7_/_TCK_/_SWCLK)
TDI: ARM_JTAG.8 R10.1(T1) U7.33(PB4_/_TDI)
TDO: ARM_JTAG.6 R11.1(T1) U7.49(PB5_/_TDO_/_TRACESWO) ; off-sheet DRV2_PWM_H  [also labelled DRV2_PWM_H]
TMS: ARM_JTAG.2 R13.1(T1) U7.51(PB6_/_TMS_/_SWDIO)
UART_RX: J8.9 U7.5(PB2_/_AD6)
UART_TX: J8.10 U7.6(PB3_/_AD7)
USB_DD_N: R18.2(T2) U7.56(PB10_/_DDM)
USB_DD_P: R19.2(T2) U7.57(PB11_/_DDP)
USB_VBUS: C36.2(T2) R16.2(T2) R17.1(T1) U7.59(PB13_/_DAC0)
NetC39_1: C39.1(T1) U7.32(PA7_/_XIN32_/_PGMNVALID) Y2.2
NetC44_1: C44.1(T1) U7.31(PA8_/_XOUT32_/_PGMM0) Y2.1
NetC45_2: C45.2(T2) C46.1(T1) C47.1(T1) C48.1(T1) C49.1(T1) L3.1 U7.8(VDDOUT) U7.12(VDDCORE) U7.24(VDDCORE) U7.54(VDDCORE)
NetC50_2: C50.2(T2) C51.1(T1) L3.2 U7.64(VDDPLL)
NetD4_1: D4.1(Cathode) Q1.3(C)
NetD4_2: D4.2(Anode) R8.1(T1)
NetD5_1: D5.1(Cathode) Q2.3(C)
NetD5_2: D5.2(Anode) R9.1(T1)
NetJ7_1: J7.1 R16.1(T1)
NetJ7_2: J7.2 R18.1(T1)
NetJ7_3: J7.3 R19.1(T1)
NetQ1_1: Q1.1(B) R14.1(T1)
NetQ2_1: Q2.1(B) R15.1(T1)
NetR20_2: R20.2(T2) U7.50(JTAGSEL)
NetR21_2: R21.2(T2) U7.40(TST)

Not connected (* = marked no-connect by the designer): J7 4; J8 3; U9 5(NC)

### Layout directives
differential pair: USB_DD_N, USB_DD_P

### Notes on the sheet
- ARM - RESET
- (near RESET) AND ERASE
- ARM - 3V3
- ADC REF
- (OPTIONAL)
- NRST: It integrates a permanent pull-up resistor to VDDIO of about 100 kO
- To ensure good behaviour of USB
- ERASE: It integrates a pull-down resistor of about 100 kO to GND, so that it can be left unconnected for normal operations
- To ensure good behaviour of RTC
- Config PWMs:
  - ADC usa PWM1
  - DRV1 usa PWM2
  - DRV2 usa PWM0 invertido
  - PWM0 y PWM2 están configurados sincrónicos
  - Se usa PWMF0 (PA9) para detectar fallas en los sincrónicos
- TITLE:
- PROJECT:
- DATE:
- DESIGNER:
- Calibrador y caracterizador de sondas de corriente
- 01/04/2021
- Agustín Aon Sanchez
- REVISOR:
- Ignacio Carugati
- PAG:
- DE
- (in symbol IC_ATSAM4S8BA-AU_ATMEL, part A) SYSTEM
- (in symbol IC_ATSAM4S8BA-AU_ATMEL, part B) PORTA
- (in symbol IC_ATSAM4S8BA-AU_ATMEL, part C) PORTB

### Library data of the parts
ARM_JTAG = CON_20021121-00010C4LF_FCI: CONN HEADER 10POS DL UNSHRD SMD; Manufacturer: FCI; BOM Populate: *; Tolerance: *; Supplier Part No: *; Supplier: *; Voltage Rating: *; Value: 20021121-00010C4LF; Current Rating: *; Digikey Part Number: 609-3695-1-ND; Manufacturer Part Number: 20021121-00010C4LF; Mouser Part Number: 649-202112100010C4LF
C14 C31 C36 C40-C43 C46-C50 = CAP_CC0805KRX7R8BB104_YAGEO: as C11 on sheet tesis_page1_supply; Supplier: *; Tolerance: 10%; Power Rating: *; Voltage Rating: 25V; BOM Populate: *; Digikey Part Number: 311-1141-1-ND; Mouser Part Number: 603-CC805KRX7R8BB104; Manufacturer Part Number: CC0805KRX7R8BB104
C32 C35 C39 C44 = CAP_C0805X150J5GACTU_KEMET: CAP CER 15PF 50V NP0 0805; Manufacturer: Kemet; Tolerance: 5%; Digikey Part Number: 399-7428-1-ND; Supplier: *; Power Rating: *; Voltage Rating: 50V; BOM Populate: *; Mouser Part Number: 80-C0805X150J5G; Manufacturer Part Number: C0805X150J5GACTU
C33 C34 = CAP_CC0805KKX7R7BB105_YAGEO: CAP CER 1UF 16V X7R 0805; Manufacturer: YAGEO; Tolerance: 10%; Supplier: *; Supplier Part No: *; Power Rating: *; BOM Populate: *; Voltage Rating: 16V; Digikey Part Number: 311-1365-1-ND; Mouser Part Number: 603-CC805KKX7R7BB105; Manufacturer Part Number: CC0805KKX7R7BB105
C37 C38 C45 C51 = CAP_CL21A106KOCL3RC: as C8 on sheet tesis_page1_supply; Voltage Rating: 16V; Manufacturer Part Number: CL21A106KOCL3RC; Supplier 1: Future Electronics; RoHS: Yes; Category: Ceramic Capacitors; Stock 1: 3934; Pricing 1: 1=0,10400, 50=0,08230, 100=0,07900, 500=0,07190, 1500=0,06740 (USD); Mount: Surface Mount; Case/Package: 0805; Case Code (Metric): 2012; Case Code (Imperial): 0805; Min Operating Temperature: -55°C; Max Operating Temperature: 85°C; Package Quantity: 1; Packaging: Tape and Reel; Length: 0.079inch; Width: 0.049inch; Thickness: 0.037inch; ComponentLink1URL: https://datasheet.ciiva.com/25796/cl21a106kocl3rc-25796224.pdf?src-supplier=Digi-Key; ComponentLink1Description: https://datasheet.ciiva.com/25796/cl21a106kocl3rc-25796224.pdf?src-supplier=Digi-Key; Supplier Part Number 1: 8109145; Capacitance: 10µF
D4 = DIO_150080RS75000_WURTH: LED RED CLEAR 0805 SMD; Manufacturer: Wurth Electronics Inc.; Manufacturer Part Number: 150080RS75000; Digikey Part Number: 732-4984-1-ND; Mouser Part Number: 710-150080RS75000
D5 = DIO_150080VS75000_WURTH: LED GREEN CLEAR 0805 SMD; Manufacturer: Wurth Electronics Inc.; Manufacturer Part Number: 150080VS75000; Digikey Part Number: 732-4986-1-ND; Mouser Part Number: 710-150080VS75000
J7 = CON_MINI_USB: CONN RCPT MINI USB2.0 5POS SLD; Manufacturer Part Number: UX60SC-MB-5S8; Manufacturer: Hirose Electric Co Ltd; Digikey Part Number: H11589CT-ND; Mouser Part Number: 798-UX60SC-MB-5S8
J21 = MSC_B3F-1000_OMRON: SWITCH TACTILE SPST-NO 0.05A 24V; Manufacturer: Omron Electronics Inc-EMC Div; Mouser Part Number: 653-B3F-1000; Manufacturer Part Number: B3F-1000; Digikey Part Number: SW400-ND
L3 = MAG_PM1812-100J-RC: FIXED IND 10UH 250mA 1.6 OHM SMD; Manufacturer: Bourns Inc; Manufacturer Part Number: CM453232-100KL; BOM Populate: *; Current Rating: *; Supplier: *; Supplier Part No: *; Voltage Rating: *; Tolerance: *; Digikey Part Number: CM453232-100KLCT-ND; Mouser Part Number: 652-CM453232-100KL
Q1 Q2 = Q_MMBT2222A-7-F_DIODES: TRANS NPN 40V 0.6A SMD SOT23-3; Manufacturer Part Number: MMBT2222A-FDICT-ND; Mouser Part Number: 621-MMBT2222A-F; Digikey Part Number: MMBT2222A-7-F
R8 R9 = RES_RC0805FR-07130RL_YAGEO: as R4 on sheet tesis_page1_supply; BOM Populate: *; Supplier Part No: *; Supplier: *; Digikey Part Number: 311-130CRCT-ND; Power Rating: 1/8W; Manufacturer Part Number: RC0805FR-07130RL; Mouser Part Number: 603-RC0805FR-07130RL
R10-R13 = RES_AC0805JR-07100KL_YAGEO: RES SMD 100K OHM 5% 1/8W 0805; Manufacturer: Yageo; BOM Populate: *; Supplier Part No: *; Supplier: *; Tolerance: 5%; Digikey Part Number: YAG3756CT-ND; Power Rating: 1/8W; Manufacturer Part Number: AC0805JR-07100KL; Mouser Part Number: 603-AC0805JR-07100KL
R14 R15 = RES_RC0805FR-0710KL_YAGEO: RES SMD 10K OHM 1% 1/8W 0805; Manufacturer: Yageo; BOM Populate: *; Supplier Part No: *; Supplier: *; Digikey Part Number: 311-10.0KCRCT-ND; Power Rating: 1/8W; Manufacturer Part Number: RC0805FR-0710KL; Mouser Part Number: 603-RC0805FR-0710KL; Tolerance: 1%
R16 = RES_RC1206JR-07100KL_YAGEO: RES SMD 100K OHM 5% 1/4W 1206; Manufacturer: YAGEO; Tolerance: 5%; BOM Populate: *; Digikey Part Number: 311-100KERCT-ND; Power Rating: 1/4W; Manufacturer Part Number: RC1206JR-07100KL; Mouser Part Number: 603-RC1206JR-07100KL
R17 = RES_RC1206JR-07180KL_YAGEO: RES SMD 180K OHM 5% 1/4W 1206; Manufacturer: YAGEO; Tolerance: 5%; BOM Populate: *; Digikey Part Number: 311-180KERCT-ND; Power Rating: 1/4W; Manufacturer Part Number: RC1206JR-07180KL; Mouser Part Number: 603-RC1206JR-07180KL
R18 R19 = RES_AC0805JR-0722RL_YAGEO: RES SMD 22 OHM 5% 1/8W 0805; Manufacturer: Yageo; Tolerance: 5%; BOM Populate: *; Supplier Part No: *; Supplier: *; Digikey Part Number: 311-22ARCT-ND; Power Rating: 1/8W; Manufacturer Part Number: AC0805JR-0722RL; Mouser Part Number: 603-AC0805JR-0722RL
R20-R22 = RES_RC0805JR-0710KL_YAGEO: RES SMD 10K OHM 5% 1/8W 0805; Manufacturer: Yageo; BOM Populate: *; Supplier Part No: *; Supplier: *; Tolerance: 5%; Digikey Part Number: 311-10KARCT-ND; Power Rating: 1/8W; Manufacturer Part Number: RC0805JR-0710KL; Mouser Part Number: 603-RC0805JR-0710KL
R23 R24 = RES_RC0805FR-074K7L_YAGEO: RES SMD 4.7K OHM 1% 1/8W 0805; Manufacturer: Yageo; BOM Populate: *; Supplier Part No: *; Supplier: *; Digikey Part Number: 311-4.70KCRCT-ND; Power Rating: 1/8W; Manufacturer Part Number: RC0805FR-074K7L; Mouser Part Number: 603-RC0805FR-074K7L; Tolerance: 1%
U7 = IC_ATSAM4S8BA-AU_ATMEL: IC MCU 32BIT 512KB FLASH 64LQFP; Manufacturer: Atmel; BOM Populate: *; Power Rating: *; Supplier: *; Supplier Part No: *; Tolerance: *; Value: ATSAM4S; Voltage Rating: *; Digikey Part Number: ATSAM4S8BA-AU-ND; Manufacturer Part Number: ATSAM4S8BA-AU; Mouser Part Number: 556-ATSAM4S8BA-AU
U8 = IC_ISL21010_3V0_INTERSIL: IC VREF SERIES 3V SOT23-3; Manufacturer Part Number: ISL21010CFH330Z-TK; Digikey Part Number: ISL21010CFH330Z-TKCT-ND; Mouser Part Number: 968-ISL21010CFH330ZT
U9 = IC_FT24C04A-KLR-T: Manufacturer: Fremont Micro Devices; Memory Type: Non-Volatile,EEPROM; Memory Size: 4Kb; Frequency: 1MHz; Access Time: 550ns; Supplier 1: Digi-Key; Supplier Part Number 1: 1219-1227-2-ND; Manufacturer Part Number: FT24C04A-KLR-T; RoHS: No; Category: Memory; Stock 1: 3000; Pricing 1: 3000=0,14616 (USD); Mount: Surface Mount; Case/Package: SOT-23-5; Min Operating Temperature: -40°C; Max Operating Temperature: 85°C; ComponentLink1URL: https://img1.wsimg.com/blobby/go/d0f1813f-418c-4780-8b0e-f456f226885c/downloads/1bs92tefg_846599.pdf?src-supplier=Digi-Key; ComponentLink1Description: https://img1.wsimg.com/blobby/go/d0f1813f-418c-4780-8b0e-f456f226885c/downloads/1bs92tefg_846599.pdf?src-supplier=Digi-Key
Y1 = MSC_ECS-120-20-3X-TR_ECS: 12 MHz ±30 ppm Cristales 20 pF 60 Ohm -10°C ~ 70°C Montaje en superficie HC49/US; Manufacturer: ECS Inc.; BOM Populate: *; Digikey Part Number: XC1770DKR-ND; Supplier: *; Supplier Part No: *; Tolerance: *; Power Rating: *; Voltage Rating: *; Manufacturer Part Number: ECS-120-20-3X-TR; Mouser Part Number: 520-120-20-3XT
Y2 = MSC_ECS-.327-12.5-34S-TR_ECS: CRYSTAL 32.7680KHZ 12.5PF SMD; Manufacturer: ECS; BOM Populate: *; Digikey Part Number: XC1967CT-ND; Supplier: *; Supplier Part No: *; Tolerance: *; Power Rating: *; Voltage Rating: *; Manufacturer Part Number: ECS-.327-12.5-34S-TR; Mouser Part Number: 520-ECS32.7-12.534ST